# Altium schematic sheet 1 - STM32.SchDoc
size Tabloid
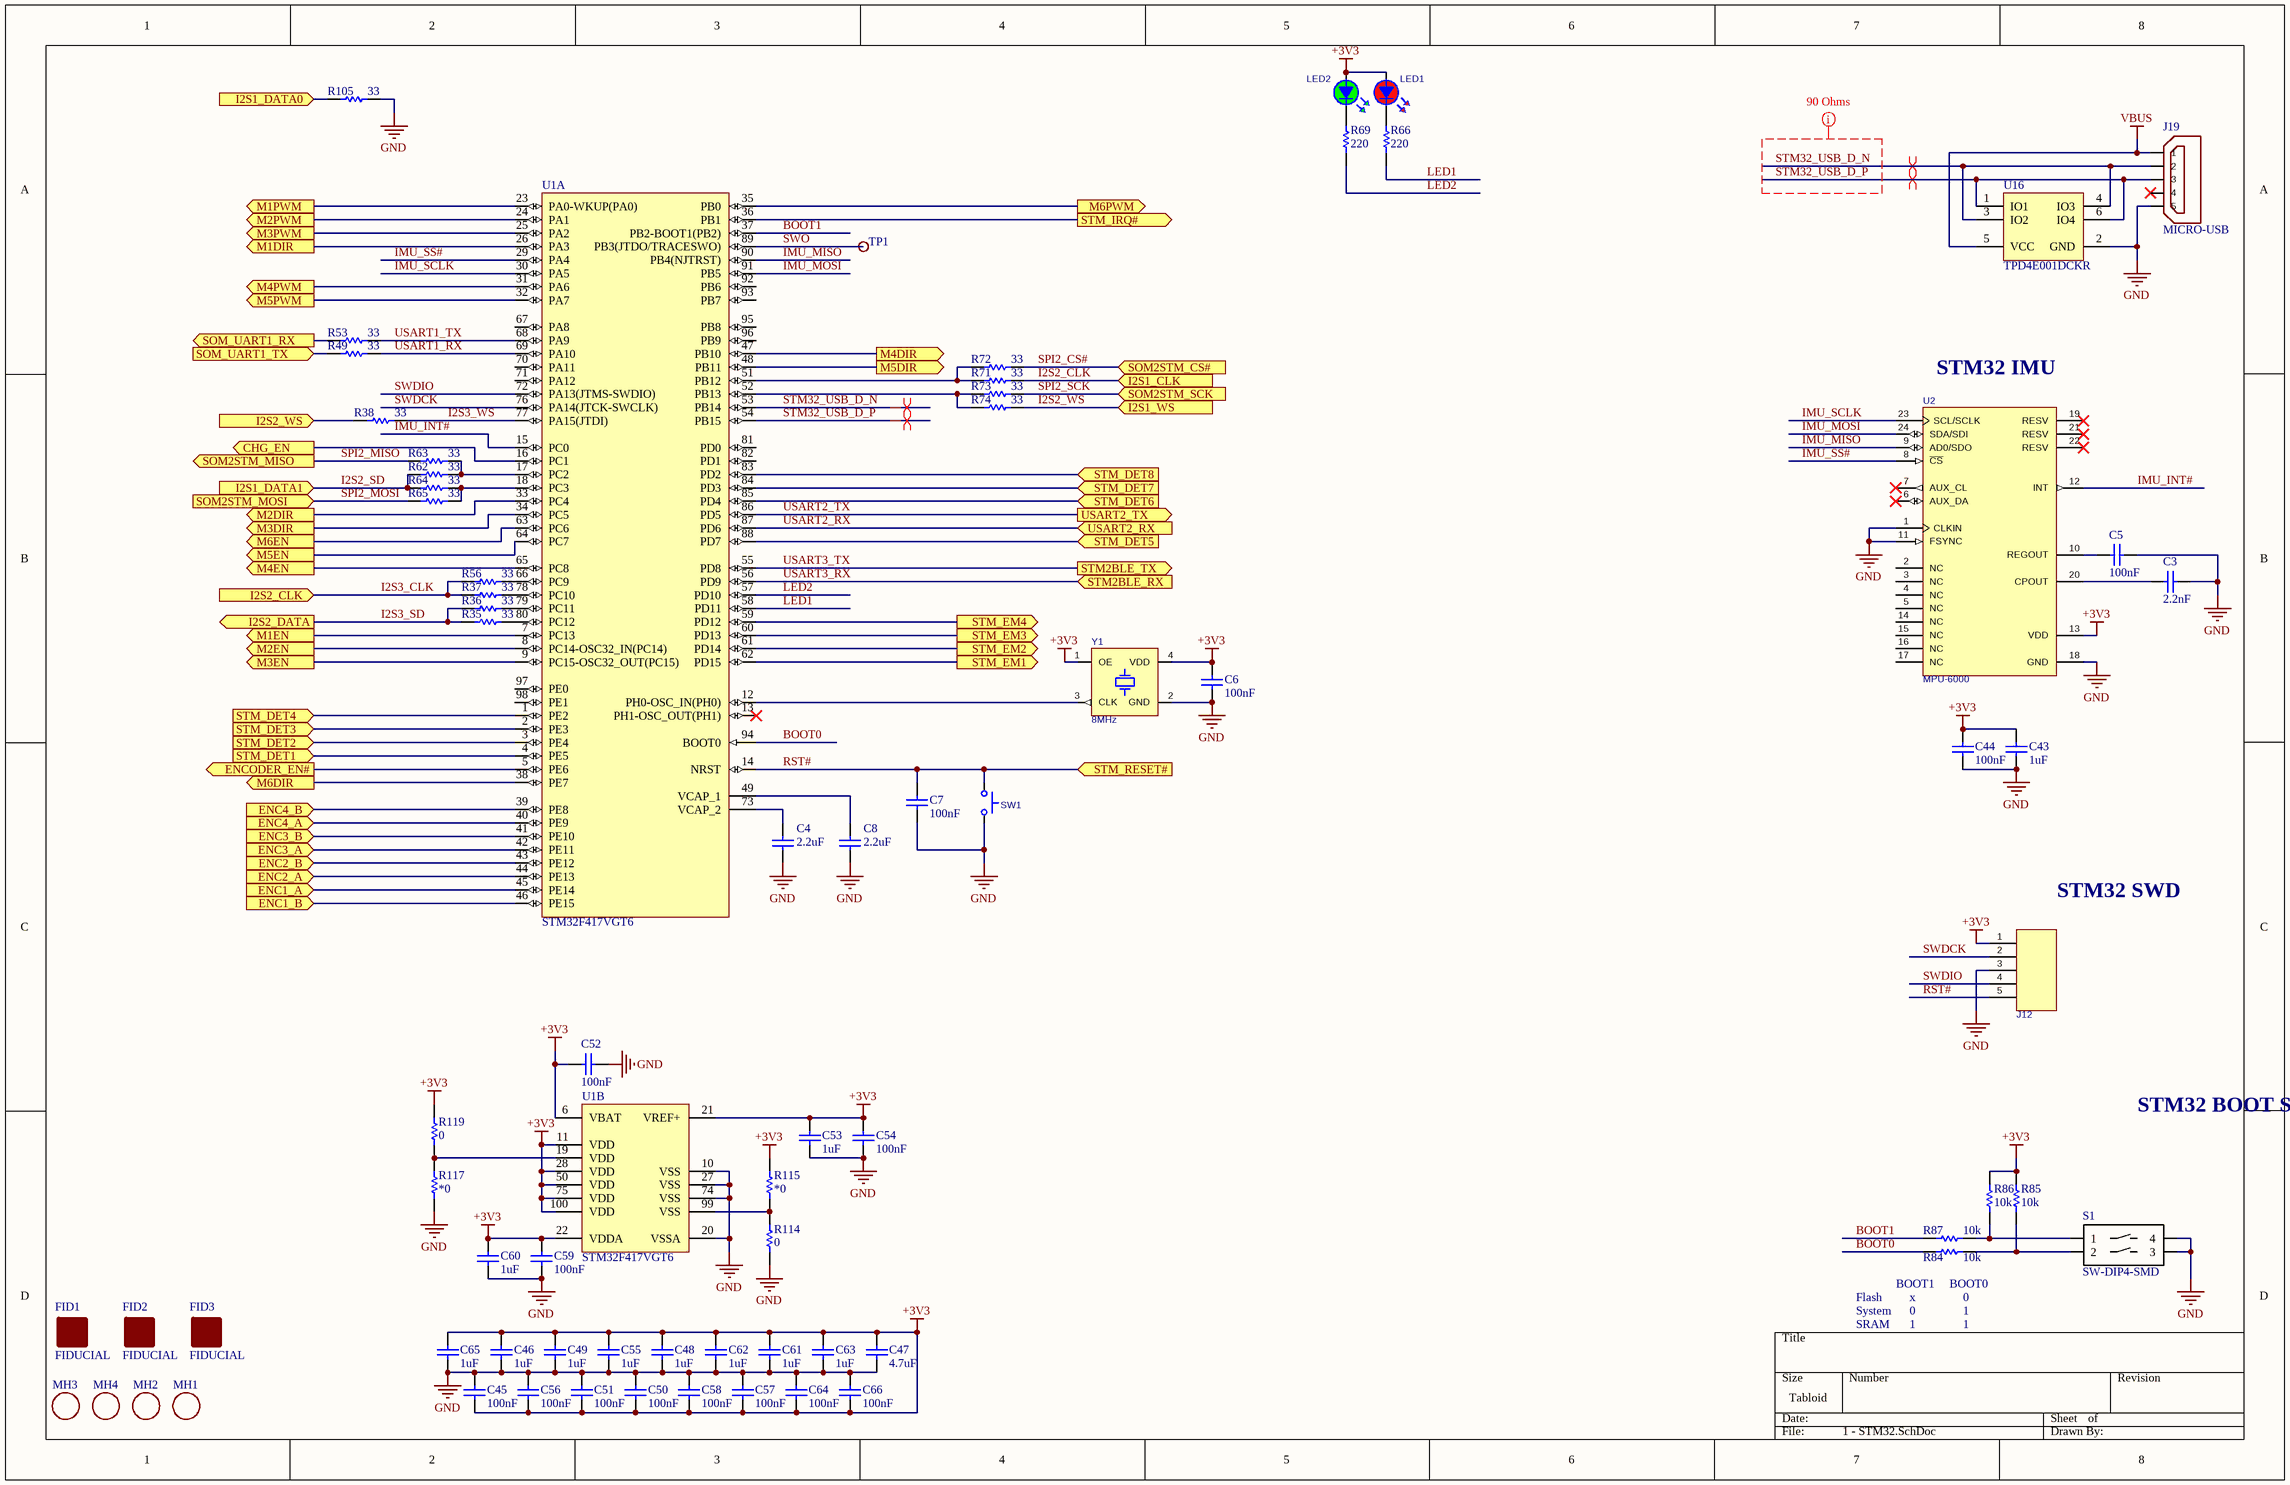
[diagram p0: 1 - STM32.SchDoc]

## Parts
(Parts that share a designator on the sheet are numbered #1, #2 ... from top to bottom, then left to right.)
C3  value 2.2nF  [CAPC0805(2012)100_L]
C4  value 2.2uF  [CAPC0805(2012)100_L]  (hidden comment: CAP 2.2uF 6.3V 0805(2012))
C5  value 100nF  [CAPC0805(2012)100_L]  (hidden comment: CAP 100nF 6.3V 0805(2012))
C6  value 100nF  [CAPC0805(2012)100_L]  (hidden comment: CAP 100nF 6.3V 0805(2012))
C7  value 100nF  [CAPC0805(2012)100_L]  (hidden comment: CAP 100nF 6.3V 0805(2012))
C8  value 2.2uF  [CAPC0805(2012)100_L]  (hidden comment: CAP 2.2uF 6.3V 0805(2012))
C43  value 1uF  [CAPC0805(2012)100_L]  (hidden comment: CAP 1uF 6.3V 0805(2012))
C44  value 100nF  [CAPC0805(2012)100_L]  (hidden comment: CAP 100nF 6.3V 0805(2012))
C45  value 100nF  [CAPC0805(2012)100_L]  (hidden comment: CAP 100nF 6.3V 0805(2012))
C46  value 1uF  [CAPC0805(2012)100_L]  (hidden comment: CAP 1uF 6.3V 0805(2012))
C47  value 4.7uF  [CAPC0805(2012)100_L]  (hidden comment: CAP 4.7uF 6.3V 0805(2012))
C48  value 1uF  [CAPC0805(2012)100_L]  (hidden comment: CAP 1uF 6.3V 0805(2012))
C49  value 1uF  [CAPC0805(2012)100_L]  (hidden comment: CAP 1uF 6.3V 0805(2012))
C50  value 100nF  [CAPC0805(2012)100_L]  (hidden comment: CAP 100nF 6.3V 0805(2012))
C51  value 100nF  [CAPC0805(2012)100_L]  (hidden comment: CAP 100nF 6.3V 0805(2012))
C52  value 100nF  [CAPC0805(2012)100_L]  (hidden comment: CAP 100nF 6.3V 0805(2012))
C53  value 1uF  [CAPC0805(2012)100_L]  (hidden comment: CAP 1uF 6.3V 0805(2012))
C54  value 100nF  [CAPC0805(2012)100_L]  (hidden comment: CAP 100nF 6.3V 0805(2012))
C55  value 1uF  [CAPC0805(2012)100_L]  (hidden comment: CAP 1uF 6.3V 0805(2012))
C56  value 100nF  [CAPC0805(2012)100_L]  (hidden comment: CAP 100nF 6.3V 0805(2012))
C57  value 100nF  [CAPC0805(2012)100_L]  (hidden comment: CAP 100nF 6.3V 0805(2012))
C58  value 100nF  [CAPC0805(2012)100_L]  (hidden comment: CAP 100nF 6.3V 0805(2012))
C59  value 100nF  [CAPC0805(2012)100_L]  (hidden comment: CAP 100nF 6.3V 0805(2012))
C60  value 1uF  [CAPC0805(2012)100_L]  (hidden comment: CAP 1uF 6.3V 0805(2012))
C61  value 1uF  [CAPC0805(2012)100_L]  (hidden comment: CAP 1uF 6.3V 0805(2012))
C62  value 1uF  [CAPC0805(2012)100_L]  (hidden comment: CAP 1uF 6.3V 0805(2012))
C63  value 1uF  [CAPC0805(2012)100_L]  (hidden comment: CAP 1uF 6.3V 0805(2012))
C64  value 100nF  [CAPC0805(2012)100_L]  (hidden comment: CAP 100nF 6.3V 0805(2012))
C65  value 1uF  [CAPC0805(2012)100_L]  (hidden comment: CAP 1uF 6.3V 0805(2012))
C66  value 100nF  [CAPC0805(2012)100_L]  (hidden comment: CAP 100nF 6.3V 0805(2012))
FID1  FIDUCIAL  [FIDUCIAL]
FID2  FIDUCIAL  [FIDUCIAL]
FID3  FIDUCIAL  [FIDUCIAL]
J12  DF13-5P-1.25DS(20)  [HRS_DF13-5P-1.25DS(20)]  (value not drawn)
J19  MICRO-USB  [USB_MICRO_B_SMT]
LED1  VLMS1500-GS08  [LEDC0402(1005)_N-RED]  (value not drawn)
LED2  VLMG1500-GS08  [LEDC0402(1005)_N-GRN]  (value not drawn)
MH1  MOUNTING_HOLE125  [HOLE_MTG_125]  (value not drawn)
MH2  MOUNTING_HOLE125  [HOLE_MTG_125]  (value not drawn)
MH3  MOUNTING_HOLE125  [HOLE_MTG_125]  (value not drawn)
MH4  MOUNTING_HOLE125  [HOLE_MTG_125]  (value not drawn)
R35  value 33  [RESC0805(2012)_L]
R36  value 33  [RESC0805(2012)_L]
R37  value 33  [RESC0805(2012)_L]
R38  value 33  [RESC0805(2012)_L]
R49  value 33  [RESC0805(2012)_L]
R53  value 33  [RESC0805(2012)_L]
R56  value 33  [RESC0805(2012)_L]
R62  value 33  [RESC0805(2012)_L]
R63  value 33  [RESC0805(2012)_L]
R64  value 33  [RESC0805(2012)_L]
R65  value 33  [RESC0805(2012)_L]
R66  value 220  [RESC0805(2012)_L]
R69  value 220  [RESC0805(2012)_L]
R71  value 33  [RESC0805(2012)_L]
R72  value 33  [RESC0805(2012)_L]
R73  value 33  [RESC0805(2012)_L]
R74  value 33  [RESC0805(2012)_L]
R84  value 10k  [RESC0805(2012)_L]  (hidden comment: 10K 1% 0805(2012))
R85  value 10k  [RESC0805(2012)_L]  (hidden comment: 10K 1% 0805(2012))
R86  value 10k  [RESC0805(2012)_L]  (hidden comment: 10K 1% 0805(2012))
R87  value 10k  [RESC0805(2012)_L]  (hidden comment: 10K 1% 0805(2012))
R105  value 33  [RESC0805(2012)_L]
R114  value 0  [RESC0805(2012)_L]  (hidden comment: Jumper 0805(2012))
R115  value *0  [RESC0805(2012)_L]  (hidden comment: Jumper 0805(2012))
R117  value *0  [RESC0805(2012)_L]  (hidden comment: Jumper 0805(2012))
R119  value 0  [RESC0805(2012)_L]  (hidden comment: Jumper 0805(2012))
S1  SW-DIP4-SMD  [SO4SW]
SW1  KMR211GLFS  [KMR2]  (value not drawn)
TP1  Various test points  [TESTPOINT_035HOLE]  (value not drawn)
U1#1  STM32F417VGT6  [STM-LQFP100_M]  (part A of 2)
U1#2  STM32F417VGT6  [STM-LQFP100_M]  (part B of 2)
U2  MPU-6000  [QFN-ML24_N_NOPAD]
U16  TPD4E001DCKR  [DCK0006A_M]
Y1  8MHz  [OSC_DFN165P250X90-4N]

## Ports
CHG_EN (out), ENC1_A (in), ENC1_B (in), ENC2_A (in), ENC2_B (in), ENC3_A (in), ENC3_B (in), ENC4_A (in), ENC4_B (in), ENCODER_EN# (out), I2S1_CLK (in), I2S1_DATA0 (in), I2S1_DATA1 (in), I2S1_WS (in), I2S2_CLK (in), I2S2_DATA (out), I2S2_WS (in), M1DIR (out), M1EN (out), M1PWM (out), M2DIR (out), M2EN (out), M2PWM (out), M3DIR (out), M3EN (out), M3PWM (out), M4DIR (out), M4EN (out), M4PWM (out), M5DIR (out), M5EN (out), M5PWM (out), M6DIR (out), M6EN (out), M6PWM (out), SOM2STM_CS# (in), SOM2STM_MISO (out), SOM2STM_MOSI (in), SOM2STM_SCK (in), SOM_UART1_RX (out), SOM_UART1_TX (in), STM2BLE_RX (in), STM2BLE_TX (out), STM_DET1 (in), STM_DET2 (in), STM_DET3 (in), STM_DET4 (in), STM_DET5 (in), STM_DET6 (in), STM_DET7 (in), STM_DET8 (in), STM_EM1 (out), STM_EM2 (out), STM_EM3 (out), STM_EM4 (out), STM_IRQ# (out), STM_RESET# (in), USART2_RX (in), USART2_TX (out)

## Nets
+3V3: C6.1 C43.1 C44.1 C45.1 C46.2 C47.2 C48.2 C49.2 C50.1 C51.1 C52.1 C53.1 C54.2 C55.2 C56.1 C57.1 C58.1 C59.1 C60.1 C61.2 C62.2 C63.2 C64.1 C65.2 C66.1 J12.1 LED1.A LED2.A R85.1 R86.1 R115.2 R119.2 U1#2.6(VBAT) U1#2.11(VDD) U1#2.21(VREF+) U1#2.22(VDDA) U1#2.28(VDD) U1#2.50(VDD) U1#2.75(VDD) U1#2.100(VDD) U2.13(VDD) Y1.1(OE) Y1.4(VDD)
GND: C3.2 C4.1 C5.2 C6.2 C7.2 C8.1 C43.2 C44.2 C45.2 C46.1 C47.1 C48.1 C49.1 C50.2 C51.2 C52.2 C53.2 C54.1 C55.1 C56.2 C57.2 C58.2 C59.2 C60.2 C61.1 C62.1 C63.1 C64.2 C65.1 C66.2 J12.3 J19.ID(5) R105.1 R114.1 R117.1 S1.3 S1.4 SW1.3 U1#2.10(VSS) U1#2.20(VSSA) U1#2.27(VSS) U1#2.74(VSS) U2.1(CLKIN) U2.11(FSYNC) U2.18(GND) U16.2(GND) Y1.2(GND)
VBUS: J19.VBUS(1) U16.5(VCC)
BOOT0: R84.2 U1#1.94(BOOT0)
BOOT1: R87.2 U1#1.37(PB2-BOOT1(PB2))
CHG_EN: U1#1.16(PC1) ; port CHG_EN
ENC1_A: U1#1.45(PE14) ; port ENC1_A
ENC1_B: U1#1.46(PE15) ; port ENC1_B
ENC2_A: U1#1.44(PE13) ; port ENC2_A
ENC2_B: U1#1.43(PE12) ; port ENC2_B
ENC3_A: U1#1.42(PE11) ; port ENC3_A
ENC3_B: U1#1.41(PE10) ; port ENC3_B
ENC4_A: U1#1.40(PE9) ; port ENC4_A
ENC4_B: U1#1.39(PE8) ; port ENC4_B
ENCODER_EN#: U1#1.5(PE6) ; port ENCODER_EN#
I2S1_DATA0: R105.2 ; port I2S1_DATA0
I2S2_CLK: R71.1 ; port I2S1_CLK
I2S2_SD: R62.2 R64.2 ; port I2S1_DATA1
I2S2_WS: R38.2 ; port I2S2_WS
I2S2_WS: R74.1 ; port I2S1_WS  [a separate net that carries the same name]
I2S3_CLK: R37.2 R56.2 ; port I2S2_CLK
I2S3_SD: R35.2 R36.2 ; port I2S2_DATA
I2S3_WS: R38.1 U1#1.77(PA15(JTDI))
IMU_INT#: U1#1.15(PC0) U2.12(INT)
IMU_MISO: U1#1.90(PB4(NJTRST)) U2.9(AD0/SDO)
IMU_MOSI: U1#1.91(PB5) U2.24(SDA/SDI)
IMU_SCLK: U1#1.30(PA5) U2.23(SCL/SCLK)
IMU_SS#: U1#1.29(PA4) U2.8(~{CS})
LED1: R66.2 U1#1.58(PD11)
LED2: R69.2 U1#1.57(PD10)
M1DIR: U1#1.26(PA3) ; port M1DIR
M1EN: U1#1.7(PC13) ; port M1EN
M1PWM: U1#1.23(PA0-WKUP(PA0)) ; port M1PWM
M2DIR: U1#1.33(PC4) ; port M2DIR
M2EN: U1#1.8(PC14-OSC32_IN(PC14)) ; port M2EN
M2PWM: U1#1.24(PA1) ; port M2PWM
M3DIR: U1#1.34(PC5) ; port M3DIR
M3EN: U1#1.9(PC15-OSC32_OUT(PC15)) ; port M3EN
M3PWM: U1#1.25(PA2) ; port M3PWM
M4DIR: U1#1.47(PB10) ; port M4DIR
M4EN: U1#1.65(PC8) ; port M4EN
M4PWM: U1#1.31(PA6) ; port M4PWM
M5DIR: U1#1.48(PB11) ; port M5DIR
M5EN: U1#1.64(PC7) ; port M5EN
M5PWM: U1#1.32(PA7) ; port M5PWM
M6DIR: U1#1.38(PE7) ; port M6DIR
M6EN: U1#1.63(PC6) ; port M6EN
M6PWM: U1#1.35(PB0) ; port M6PWM
RST#: C7.1 J12.5 SW1.1 U1#1.14(NRST) ; port STM_RESET#
SOM_UART1_RX: R53.2 ; port SOM_UART1_RX
SOM_UART1_TX: R49.2 ; port SOM_UART1_TX
SPI2_CS#: R72.1 ; port SOM2STM_CS#
SPI2_MISO: R63.2 ; port SOM2STM_MISO
SPI2_MOSI: R65.2 ; port SOM2STM_MOSI
SPI2_SCK: R73.1 ; port SOM2STM_SCK
STM32_USB_D_N: J19.D-(2) U1#1.53(PB14) U16.3(IO2) U16.4(IO3)
STM32_USB_D_P: J19.D+(3) U1#1.54(PB15) U16.1(IO1) U16.6(IO4)
STM_DET1: U1#1.4(PE5) ; port STM_DET1
STM_DET2: U1#1.3(PE4) ; port STM_DET2
STM_DET3: U1#1.2(PE3) ; port STM_DET3
STM_DET4: U1#1.1(PE2) ; port STM_DET4
STM_DET5: U1#1.88(PD7) ; port STM_DET5
STM_DET6: U1#1.85(PD4) ; port STM_DET6
STM_DET7: U1#1.84(PD3) ; port STM_DET7
STM_DET8: U1#1.83(PD2) ; port STM_DET8
STM_EM1: U1#1.62(PD15) ; port STM_EM1
STM_EM2: U1#1.61(PD14) ; port STM_EM2
STM_EM3: U1#1.60(PD13) ; port STM_EM3
STM_EM4: U1#1.59(PD12) ; port STM_EM4
STM_IRQ#: U1#1.36(PB1) ; port STM_IRQ#
SWDCK: J12.2 U1#1.76(PA14(JTCK-SWCLK))
SWDIO: J12.4 U1#1.72(PA13(JTMS-SWDIO))
SWO: TP1.1 U1#1.89(PB3(JTDO/TRACESWO))
USART1_RX: R49.1 U1#1.69(PA10)
USART1_TX: R53.1 U1#1.68(PA9)
USART2_RX: U1#1.87(PD6) ; port USART2_RX
USART2_TX: U1#1.86(PD5) ; port USART2_TX
USART3_RX: U1#1.56(PD9) ; port STM2BLE_RX
USART3_TX: U1#1.55(PD8) ; port STM2BLE_TX
NetC3_1: C3.1 U2.20(CPOUT)
NetC4_2: C4.2 U1#1.73(VCAP_2)
NetC5_1: C5.1 U2.10(REGOUT)
NetC8_2: C8.2 U1#1.49(VCAP_1)
NetLED1_K: LED1.K R66.1
NetLED2_K: LED2.K R69.1
NetR35_1: R35.1 U1#1.80(PC12)
NetR36_1: R36.1 U1#1.79(PC11)
NetR37_1: R37.1 U1#1.78(PC10)
NetR56_1: R56.1 U1#1.66(PC9)
NetR62_1: R62.1 R63.1 U1#1.17(PC2)
NetR64_1: R64.1 R65.1 U1#1.18(PC3)
NetR71_2: R71.2 R72.2 U1#1.51(PB12)
NetR73_2: R73.2 R74.2 U1#1.52(PB13)
NetR84_1: R84.1 R85.2 S1.2
NetR86_2: R86.2 R87.1 S1.1
NetR114_2: R114.2 R115.1 U1#2.99(VSS)
NetR117_2: R117.2 R119.1 U1#2.19(VDD)
NetU1#1_12: U1#1.12(PH0-OSC_IN(PH0)) Y1.3(CLK)

Not connected (* = marked no-connect by the designer): J19 GND(4)*; SW1 2 4; U1#1 13(PH1-OSC_OUT(PH1))* 67(PA8) 70(PA11) 71(PA12) 81(PD0) 82(PD1) 92(PB6) 93(PB7) 95(PB8) 96(PB9) 97(PE0) 98(PE1); U2 2(NC) 3(NC) 4(NC) 5(NC) 6(AUX_DA)* 7(AUX_CL)* 14(NC) 15(NC) 16(NC) 17(NC) 19(RESV)* 21(RESV)* 22(RESV)*

## Layout directives
differential pair: STM32_USB_D_N, STM32_USB_D_P
rule Impedance Constraint [Min = 90.00    Max = 90.00    ]: STM32_USB_D_N, STM32_USB_D_P

## Notes on the sheet
- (near U2) STM32 IMU
- (near J12) STM32 SWD
- STM32 BOOT SELECTION
- Flash
- BOOT1
- x
- BOOT0
- 0
- System
- SRAM
- 1

## Library data of the parts
C3 = CMP-1036-04520-1: CAP 220nF 6.3V Â±20% 0805 (2012 Metric) Thickness 1mm SMD; Case-Metric: 2012; Case-EIA: 0805; Technology: SMT; Tolerance: Â±20%; Max Thickness: 1 mm; Rated Voltage: 6.3 V
C4 C8 = CMP-1036-04821-1: CAP 2.2uF 6.3V Â±20% 0805 (2012 Metric) Thickness 1mm SMD; Case-EIA: 0805; Case-Metric: 2012; Rated Voltage: 6.3 V; Tolerance: Â±20%; Technology: SMT; Max Thickness: 1 mm
C5-C7 C44 C52 C59 = CMP-1036-04391-1: CAP 100nF 6.3V Â±10% 0805 (2012 Metric) Thickness 1mm SMD; Case-EIA: 0805; Case-Metric: 2012; Rated Voltage: 6.3 V; Technology: SMT; Tolerance: Â±10%; Max Thickness: 1 mm
C43 C53 C60 = CMP-1036-04730-1: CAP 1uF 6.3V Â±5% 0805 (2012 Metric) Thickness 1mm SMD; Case-Metric: 2012; Case-EIA: 0805; Technology: SMT; Tolerance: Â±5%; Max Thickness: 1 mm; Rated Voltage: 6.3 V
C45 C50 C51 C54 C56-C58 C64 C66 = CMP-1036-04392-1: CAP 100nF 6.3V Â±20% 0805 (2012 Metric) Thickness 1mm SMD; Case-Metric: 2012; Case-EIA: 0805; Max Thickness: 1 mm; Technology: SMT; Tolerance: Â±20%; Rated Voltage: 6.3 V
C46 C48 C49 C55 C61-C63 C65 = CMP-1036-04734-1: CAP 1uF 6.3V Â±20% 0805 (2012 Metric) Thickness 1mm SMD; Case-Metric: 2012; Case-EIA: 0805; Max Thickness: 1 mm; Tolerance: Â±20%; Technology: SMT; Rated Voltage: 6.3 V
C47 = CMP-1036-04879-1: CAP 4.7uF 6.3V Â±20% 0805 (2012 Metric) Thickness 1mm SMD; Case-Metric: 2012; Case-EIA: 0805; Max Thickness: 1 mm; Technology: SMT; Tolerance: Â±20%; Rated Voltage: 6.3 V
J12 = CON_HRS_DF13-5P-1.25DS(20): CONN HEADER 5POS 1.25MM R/A THT TIN; Manufacturer: Hirose Electric Co Ltd; Connector Type: Header, Shrouded; Number of Positions: 5; Number of Positions Loaded: All; Pitch: 0.049" (1.25mm); Supplier 1: Digi-Key; Manufacturer Part Number: DF13-5P-1.25DS(20); RoHS: RoHS Compliant; Category: Connectors, Interconnects; Stock 1: 10851; Pricing 1: 1=0.61, 10=0.57, 50=0.456, 100=0.437, 250=0.399, 500=0.38, 1000=0.3135, 2500=0.285, 5000=0.2755 (USD); Packaging: Tube; Contact Type: Male Pin; Number of Rows: 1; Row Spacing: -; Contact Mating Length: -; Mounting Type: Through Hole, Right Angle; Termination: Solder; Fastening Type: -; Features: Board Guide; Contact Finish: Tin; Contact Finish Thickness: -; Color: Beige; ComponentLink1URL: http://www.hirose.co.jp/cataloge_hp/2d/EDC3-081818-01.pdf; ComponentLink1Description: http://www.hirose.co.jp/cataloge_hp/2d/EDC3-081818-01.pdf; Supplier Part Number 1: H2202-ND
J19 = MICRO-USB: pin to pad: D+>3 D->2 GND>4 ID>5 VBUS>1
LED1 = LED_0402_VLMS1500-GS08: LED RED 0402 SMD; Manufacturer: Vishay Semiconductor Opto Division; Wavelength - Dominant: 631nm; Wavelength - Peak: 639nm; Millicandela Rating: 54mcd; Voltage - Forward (Vf) (Typ): 2V; Current - Test: 20mA; Viewing Angle: 130°; Lens Style/Size: Rectangle with Flat Top, 1.00mm x 0.50mm; Supplier 1: Digi-Key; Manufacturer Part Number: VLMS1500-GS08; RoHS: RoHS Compliant; Category: Optoelectronics; Stock 1: 41406; Pricing 1: 1=0.52, 10=0.384, 25=0.3072, 100=0.2035, 250=0.144, 500=0.12288, 750=0.10368, 1000=0.096 (USD); Packaging: Cut Tape (CT); Color: Red; Lens Transparency: -; Lens Color: -; Package / Case: 0402 (1005 Metric); Supplier Device Package: 0402; Size / Dimension: 1.00mm L x 0.50mm W; Height (Max): 0.35mm; Mounting Type: Surface Mount; ComponentLink1URL: http://www.vishay.com/docs/82554/vlmo1500.pdf; ComponentLink1Description: http://www.vishay.com/docs/82554/vlmo1500.pdf; Supplier Part Number 1: VLMS1500-GS08CT-ND
LED2 = LED_0402_VLMG1500-GS08: LED GREEN 0402 SMD; Manufacturer: Vishay Semiconductor Opto Division; Wavelength - Dominant: 571nm; Wavelength - Peak: 574nm; Millicandela Rating: 35mcd; Voltage - Forward (Vf) (Typ): 2V; Current - Test: 20mA; Viewing Angle: 130°; Lens Style/Size: Rectangle with Flat Top, 1.00mm x 0.50mm; Supplier 1: Digi-Key; Manufacturer Part Number: VLMG1500-GS08; RoHS: RoHS Compliant; Category: Optoelectronics; Stock 1: 37065; Pricing 1: 1=0.52, 10=0.384, 25=0.3072, 100=0.2035, 250=0.144, 500=0.12288, 750=0.10368, 1000=0.096 (USD); Packaging: Cut Tape (CT); Color: Green; Lens Transparency: -; Lens Color: -; Package / Case: 0402 (1005 Metric); Supplier Device Package: 0402; Size / Dimension: 1.00mm L x 0.50mm W; Height (Max): 0.35mm; Mounting Type: Surface Mount; ComponentLink1URL: http://www.vishay.com/docs/82554/vlmo1500.pdf; ComponentLink1Description: http://www.vishay.com/docs/82554/vlmo1500.pdf; Supplier Part Number 1: VLMG1500-GS08CT-ND
R35-R38 R49 R53 R56 R62-R65 R71-R74 R84-R87 R105 = CMP-1013-00623-1: 10K 0.125W 1% 0805 (2012 Metric)  SMD; Case-Metric: 2012; Case-EIA: 0805; Tolerance: 1 %; Power: 0.125 W; Technology: SMT
R66 R69 = CMP-1013-00623-1: 220R 0.125W 1% 0805 (2012 Metric)  SMD; Case-Metric: 2012; Case-EIA: 0805; Tolerance: 1 %; Power: 0.125 W; Technology: SMT
R114 R115 R117 R119 = CMP-1013-00001-1: Jumper 0805 (2012 Metric); Case-EIA: 0805; Tolerance: None; Case-Metric: 2012; Technology: SMT; Power: None
S1 = SW-DIP4-SMD: 2 POLE DIP SWITCH SMD
SW1 = SW_KMR211G LFS: SWITCH TACTILE SPST-NO 0.05A 32V; Manufacturer: C&K Components; Switch Function: Off-Mom; Contact Rating @ Voltage: 0.05A @ 32VDC; Actuator Type: Standard; Actuator Height off PCB, from Pins: 1.90mm; Actuator Orientation: Top Actuated; Outline: 4.60mm x 2.80mm; Illumination: Non-Illuminated; Operating Force: 120gf; Switch Travel: 0.20mm; Mechanical Life: 200,000 Cycles; Supplier 1: Digi-Key; Manufacturer Part Number: KMR211GLFS; RoHS: RoHS Compliant; Category: Switches; Stock 1: 4378; Pricing 1: 1=0.51, 10=0.493, 25=0.484, 50=0.4656, 100=0.4017, 250=0.3652, 500=0.34694, 1000=0.2739 (USD); Packaging: Cut Tape (CT); Circuit: SPST-NO; Mounting Type: Surface Mount; Termination Style: Gull Wing; Illumination Voltage (Nominal): -; Illumination Type, Color: -; Ingress Protection: -; Features: Grounding Pin; Actuator Material: -; Operating Temperature: -40°C ~ 85°C; ComponentLink1URL: http://www.ck-components.com/index.php?module=media&action=Display&cmpref=14414&lang=en&width=&height=&format=&alt=; ComponentLink1Description: http://www.ck-components.com/index.php?module=media&action=Display&cmpref=14414&lang=en&width=&height=&format=&alt=; Supplier Part Number 1: 401-1426-1-ND
TP1 = TESTPOINTHOLE035
U1#1 U1#2 = CMP-0243-00014-3: ARM Cortex-M4 32-bit MCU+FPU, 210 DMIPS, 1024 kB Flash, 192 kB Internal RAM, 82 I/Os, 100-pin LQFP, -40 to 85 degC, Tray; Manufacturer: STMicroelectronics; Operating Frequency(F) (Processor speed) (MHz): 168; Supply Voltage(Vcc) max (V): 3.6; I/Os (High Current): 82; Supply Voltage(Vcc) min (V): 1.8; FLASH Size (Prog) (kB): 1024; D/A Converter: 2x12-bit; Internal RAM Size (kB): 192; Packing: Tray; PackageReference: LQFP100; PackageDescription: 100-Pin Low Profile Quad Flat Package, 14 x 14 mm Body, 0.5 mm Pitch; DatasheetVersion: Rev. 4; Mounting Technology: Surface Mount; ComponentLink3Description: Package Specification; ComponentLink1Description: Manufacturer URL; ComponentLink2URL: http://www.st.com/st-web-ui/static/active/en/resource/technical/document/datasheet/DM00035129.pdf; ComponentLink2Description: Datasheet; PartNumber: STM32F417VGT6; Core: ARM Cortex-M4; ComponentLink3URL: http://www.st.com/st-web-ui/static/active/en/resource/technical/document/data_brief/DM00071938.pdf; ComponentLink1URL: http://www.st.com/web/en/home.html; PackageVersion: Rev. 1, 06/2013
U2 = IC_MPU-6000: GYRO/ACCELEROMETER 6AXIS 24QFN I2C/SPI; Manufacturer: InvenSense; Sensor Type: Accelerometer, Gyroscope, 3 Axis; Output Type: I²C, SPI; Supplier 1: Digi-Key; Manufacturer Part Number: MPU-6000; RoHS: RoHS Compliant; Category: Sensors, Transducers; Stock 1: 27337; Pricing 1: 1=10.72, 5=9.406, 10=8.465, 25=7.524, 50=6.9598, 100=6.0192, 250=5.83112, 500=5.643, 750=5.45491 (USD); ComponentLink1URL: http://store.invensense.com/datasheets/invensense/MPU-6050_DataSheet_V3%204.pdf; ComponentLink1Description: http://store.invensense.com/datasheets/invensense/MPU-6050_DataSheet_V3%204.pdf; Supplier Part Number 1: 1428-1005-1-ND
U16 = CMP-0326-00066-2: Low-Capacitance + / - 15-kV ESD Protection Array for High-Speed Data Interfaces, 4 Channels, -40 to +85 degC, 6-pin SOT70 (DCK), Green (RoHS & no Sb/Br); Manufacturer: Texas Instruments; IO Leakage Current(nA): 1.5; IEC 61000-4-2 Air-Gap(+/- kV): 15; USB High Speed: TRUE; SubFamily: ESD Solution; IEC 61000-4-2 Contact(+/- kV): 8; Breakdown Voltage(Min)(V): 11; Mounting Technology: Surface Mount; DatasheetVersion: SLLS682G; ComponentLink1URL: http://www.ti.com/; Serial ATA / eSATA: TRUE; PackageReference: DCK0006A; ComponentLink3Description: URL Link1; ComponentLink2Description: Datasheet; 1394 / Firewire: TRUE; ComponentLink2URL: http://www.ti.com/general/docs/lit/getliterature.tsp?genericPartNumber=TPD4E001&fileType=pdf; ComponentLink1Description: Manufacturer URL; PackageVersion: revG, Jan-2007; ComponentLink3URL: SamplesURL:http://www.ti.com/product/tpd4e001#samples; PackageDescription: 6-Pin Plastic Small-Outline Package, 2 x 1.3 mm Body, 0.65 mm Pitch, 2.1 mm Lead Span; IO Capacitance(Typ)(pF): 1.5; PartNumber: TPD4E001DCKR; Eco-Plan: Green (RoHS & no Sb/Br)
Y1 = OSC_MEMS_8.000MHZ: OSC CMEMS 8.000MHZ LVCMOS SMD; Manufacturer: Silicon Labs; Manufacturer Part Number: 501ABA8M00000DAG; Function: Tri-State (Output Enable); Voltage - Supply: 1.7 V ~ 3.6 V; Frequency Stability: ±30ppm; Current - Supply (Max): 2.5mA; Supplier 1: Digi-Key; RoHS: RoHS Compliant; Category: Crystals and Oscillators; Stock 1: 150; Pricing 1: 1=1.04, 10=0.92, 50=0.86, 100=0.76, 500=0.72, 1000=0.6, 2500=0.58, 5000=0.56 (USD); Packaging: Cut Strip; Type: CMEMS®; Frequency: 8MHz; Output: LVCMOS; Operating Temperature: -40°C ~ 85°C; Ratings: -; Mounting Type: Surface Mount; Size / Dimension: 0.098" L x 0.079" W (2.50mm x 2.00mm); Height: 0.035" (0.90mm); Package / Case: 4-SMD, No Lead (DFN, LCC); Current - Supply (Disable) (Max): 2.5mA; ComponentLink1URL: http://www.silabs.com/Support%20Documents/TechnicalDocs/Si501-2-3.pdf; ComponentLink1Description: http://www.silabs.com/Support%20Documents/TechnicalDocs/Si501-2-3.pdf; Supplier Part Number 1: 336-2873-ND